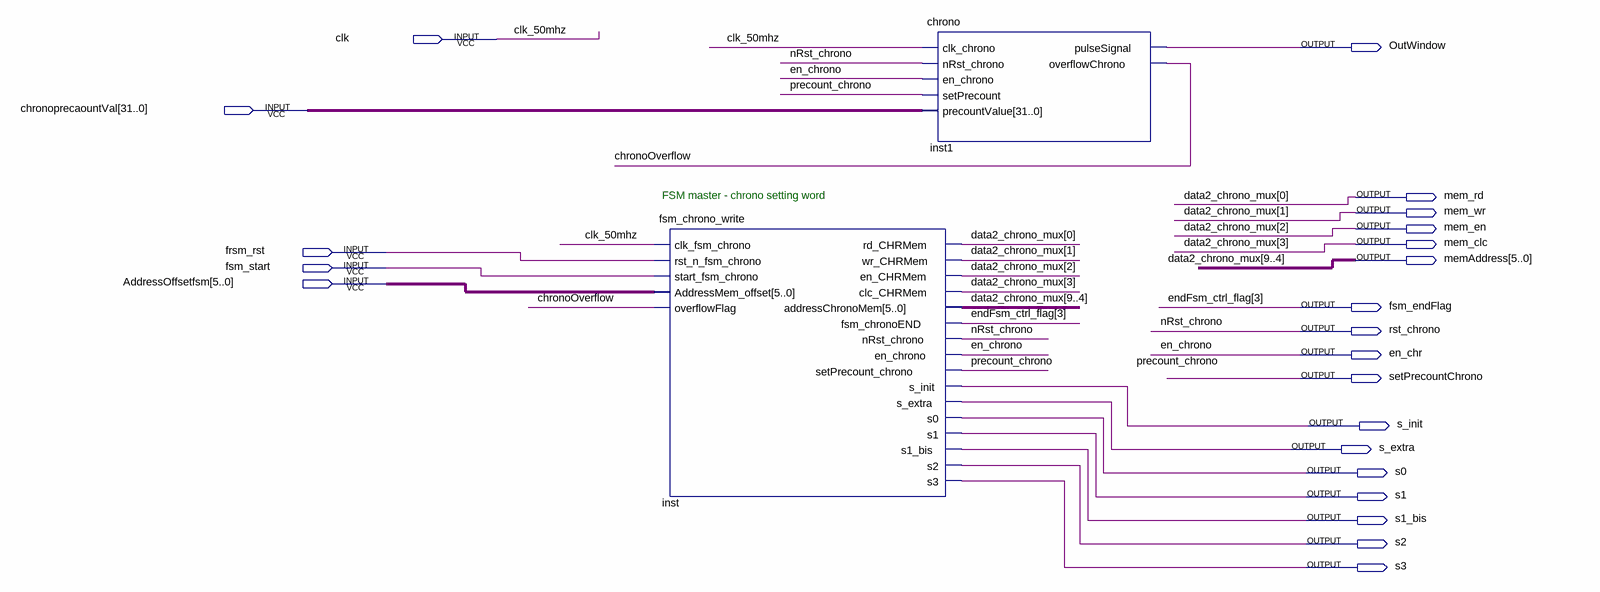
[diagram p0: schematic sheet]
// Quartus schematic fsm_chorno_sim.bdf as structural Verilog: 2 symbols, 22 pins
module fsm_chorno_sim (
  input  clk,
  input  [31:0] chronoprecaountVal,
  input  frsm_rst,
  input  fsm_start,
  input  [5:0] AddressOffsetfsm,
  output OutWindow,
  output mem_rd,
  output mem_wr,
  output mem_en,
  output mem_clc,
  output [5:0] memAddress,
  output fsm_endFlag,
  output rst_chrono,
  output en_chr,
  output setPrecountChrono,
  output s_init,
  output s_extra,
  output s0,
  output s1,
  output s1_bis,
  output s2,
  output s3
);

  wire chronoOverflow;

  fsm_chrono_write inst (
    .clk_fsm_chrono(clk), .rst_n_fsm_chrono(frsm_rst), .start_fsm_chrono(fsm_start),
    .AddressMem_offset(AddressOffsetfsm), .overflowFlag(chronoOverflow), .rd_CHRMem(mem_rd),
    .wr_CHRMem(mem_wr), .en_CHRMem(mem_en), .clc_CHRMem(mem_clc), .addressChronoMem(memAddress),
    .fsm_chronoEND(fsm_endFlag), .nRst_chrono(rst_chrono), .en_chrono(en_chr),
    .setPrecount_chrono(setPrecountChrono), .s_init(s_init), .s_extra(s_extra), .s0(s0), .s1(s1),
    .s1_bis(s1_bis), .s2(s2), .s3(s3));
  chrono inst1 (
    .clk_chrono(clk), .nRst_chrono(rst_chrono), .en_chrono(en_chr), .setPrecount(setPrecountChrono),
    .precountValue(chronoprecaountVal), .pulseSignal(OutWindow), .overflowChrono(chronoOverflow));

  // Other names for the same wires on the sheet: clk_50mhz = clk; en_chrono = en_chr;
  //   endFsm_ctrl_flag[3] = fsm_endFlag; data2_chrono_mux[9:0] = {memAddress, mem_clc, mem_en, mem_wr, mem_rd};
  //   nRst_chrono = rst_chrono; precount_chrono = setPrecountChrono

  // Notes on the sheet:
  //   FSM master - chrono setting word
endmodule
